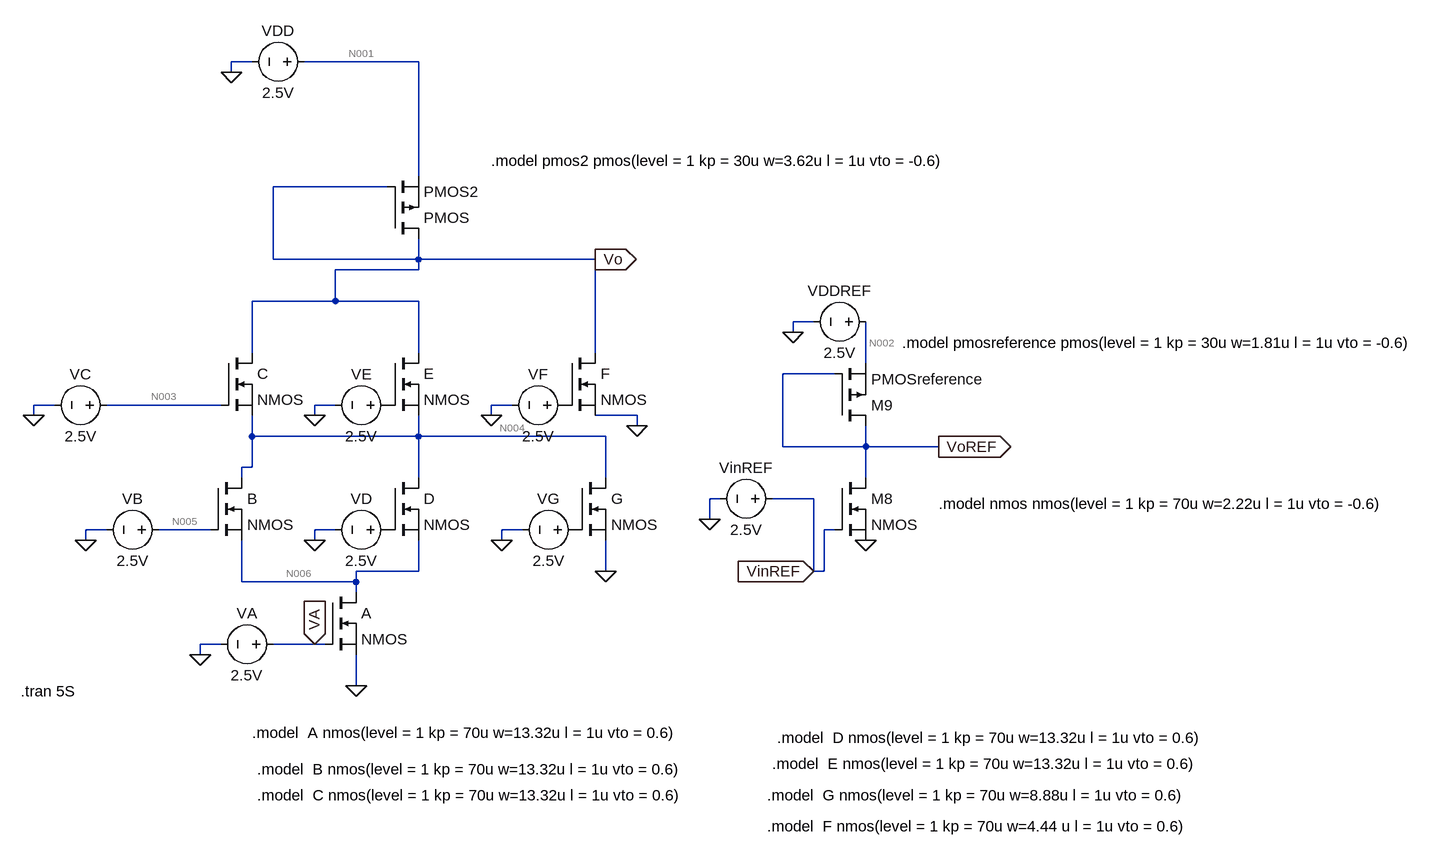
[diagram p0: schematic Draft3.asc]
Draft3.asc, the LTspice schematic file:
Version 4
SHEET 1 2076 752
WIRE 96 -448 64 -448
WIRE 352 -448 176 -448
WIRE 64 -432 64 -448
WIRE 352 -272 352 -448
WIRE 304 -256 128 -256
WIRE 128 -144 128 -256
WIRE 352 -144 352 -176
WIRE 352 -144 128 -144
WIRE 624 -144 352 -144
WIRE 352 -128 352 -144
WIRE 352 -128 224 -128
WIRE 224 -80 224 -128
WIRE 224 -80 96 -80
WIRE 352 -80 224 -80
WIRE 960 -48 928 -48
WIRE 928 -32 928 -48
WIRE 96 0 96 -80
WIRE 352 0 352 -80
WIRE 624 0 624 -144
WIRE 1040 16 1040 -48
WIRE 992 32 912 32
WIRE -208 80 -240 80
WIRE 48 80 -128 80
WIRE 224 80 192 80
WIRE 496 80 464 80
WIRE -240 96 -240 80
WIRE 192 96 192 80
WIRE 464 96 464 80
WIRE 688 96 624 96
WIRE 688 112 688 96
WIRE 96 128 96 96
WIRE 352 128 352 96
WIRE 352 128 96 128
WIRE 640 128 352 128
WIRE 912 144 912 32
WIRE 1040 144 1040 112
WIRE 1040 144 912 144
WIRE 1152 144 1040 144
WIRE 96 176 96 128
WIRE 96 176 80 176
WIRE 80 192 80 176
WIRE 352 192 352 128
WIRE 640 192 640 128
WIRE 1040 192 1040 144
WIRE 816 224 800 224
WIRE 960 224 896 224
WIRE 800 256 800 224
WIRE -128 272 -160 272
WIRE 32 272 -48 272
WIRE 224 272 192 272
WIRE 512 272 480 272
WIRE 992 272 976 272
WIRE -160 288 -160 272
WIRE 192 288 192 272
WIRE 480 288 480 272
WIRE 352 336 352 288
WIRE 352 336 256 336
WIRE 640 336 640 288
WIRE 960 336 960 224
WIRE 976 336 976 272
WIRE 976 336 960 336
WIRE 80 352 80 288
WIRE 256 352 256 336
WIRE 256 352 80 352
WIRE 256 368 256 352
WIRE 48 448 16 448
WIRE 192 448 128 448
WIRE 208 448 192 448
WIRE 16 464 16 448
WIRE 256 512 256 464
FLAG 64 -432 0
FLAG 688 112 0
FLAG 640 336 0
FLAG -240 96 0
FLAG -160 288 0
FLAG 192 96 0
FLAG 192 288 0
FLAG 464 96 0
FLAG 480 288 0
FLAG 16 464 0
FLAG 800 256 0
FLAG 1040 288 0
FLAG 928 -32 0
FLAG 1152 144 VoREF
IOPIN 1152 144 Out
FLAG 624 -144 Vo
IOPIN 624 -144 Out
FLAG 192 448 VA
IOPIN 192 448 In
FLAG 960 336 VinREF
IOPIN 960 336 In
FLAG 256 512 0
SYMBOL nmos 48 0 R0
SYMATTR InstName C
SYMBOL nmos 304 0 R0
SYMATTR InstName E
SYMBOL nmos 576 0 R0
SYMATTR InstName F
SYMBOL nmos 32 192 R0
SYMATTR InstName B
SYMBOL nmos 304 192 R0
SYMATTR InstName D
SYMBOL nmos 208 368 R0
SYMATTR InstName A
SYMBOL nmos 592 192 R0
SYMATTR InstName G
SYMBOL nmos 992 192 R0
SYMATTR InstName M8
SYMBOL pmos 992 112 M180
SYMATTR InstName M9
SYMATTR Value PMOSreference
SYMBOL pmos 304 -176 M180
SYMATTR InstName PMOS
SYMATTR Value PMOS2
SYMBOL voltage 192 -448 R90
WINDOW 0 -32 56 VBottom 2
WINDOW 3 32 56 VTop 2
SYMATTR InstName VDD
SYMATTR Value 2.5V
SYMBOL voltage -112 80 R90
WINDOW 0 -32 56 VBottom 2
WINDOW 3 32 56 VTop 2
WINDOW 123 0 0 Left 2
WINDOW 39 0 0 Left 2
SYMATTR InstName VC
SYMATTR Value 2.5V
SYMBOL voltage -32 272 R90
WINDOW 0 -32 56 VBottom 2
WINDOW 3 32 56 VTop 2
SYMATTR InstName VB
SYMATTR Value 2.5V
SYMBOL voltage 320 80 R90
WINDOW 0 -32 56 VBottom 2
WINDOW 3 32 56 VTop 2
SYMATTR InstName VE
SYMATTR Value 2.5V
SYMBOL voltage 320 272 R90
WINDOW 0 -32 56 VBottom 2
WINDOW 3 32 56 VTop 2
SYMATTR InstName VD
SYMATTR Value 2.5V
SYMBOL voltage 592 80 R90
WINDOW 0 -32 56 VBottom 2
WINDOW 3 32 56 VTop 2
SYMATTR InstName VF
SYMATTR Value 2.5V
SYMBOL voltage 608 272 R90
WINDOW 0 -32 56 VBottom 2
WINDOW 3 32 56 VTop 2
SYMATTR InstName VG
SYMATTR Value 2.5V
SYMBOL voltage 144 448 R90
WINDOW 0 -32 56 VBottom 2
WINDOW 3 32 56 VTop 2
SYMATTR InstName VA
SYMATTR Value 2.5V
SYMBOL voltage 912 224 R90
WINDOW 0 -32 56 VBottom 2
WINDOW 3 32 56 VTop 2
SYMATTR InstName VinREF
SYMATTR Value 2.5V
SYMBOL voltage 1056 -48 R90
WINDOW 0 -32 56 VBottom 2
WINDOW 3 32 56 VTop 2
SYMATTR InstName VDDREF
SYMATTR Value 2.5V
TEXT 1096 -16 Left 2 !.model pmosreference pmos(level = 1 kp = 30u w=1.81u l = 1u vto = -0.6)
TEXT 1152 232 Left 2 !.model nmos nmos(level = 1 kp = 70u w=2.22u l = 1u vto = -0.6)
TEXT -260 520 Left 2 !.tran 5S
TEXT 464 -296 Left 2 !.model pmos2 pmos(level = 1 kp = 30u w=3.62u l = 1u vto = -0.6)
TEXT 96 584 Left 2 !.model  A nmos(level = 1 kp = 70u w=13.32u l = 1u vto = 0.6)
TEXT 104 640 Left 2 !.model  B nmos(level = 1 kp = 70u w=13.32u l = 1u vto = 0.6)
TEXT 104 680 Left 2 !.model  C nmos(level = 1 kp = 70u w=13.32u l = 1u vto = 0.6)
TEXT 904 592 Left 2 !.model  D nmos(level = 1 kp = 70u w=13.32u l = 1u vto = 0.6)
TEXT 896 632 Left 2 !.model  E nmos(level = 1 kp = 70u w=13.32u l = 1u vto = 0.6)
TEXT 888 680 Left 2 !.model  G nmos(level = 1 kp = 70u w=8.88u l = 1u vto = 0.6)
TEXT 888 728 Left 2 !.model  F nmos(level = 1 kp = 70u w=4.44 u l = 1u vto = 0.6)

The netlist it stands for:
* Draft3.asc
M§C Vo N003 N004 N004 NMOS
M§E Vo P001 N004 N004 NMOS
M§F Vo P002 0 0 NMOS
M§B N004 N005 N006 N006 NMOS
M§D N004 P003 N006 N006 NMOS
M§A N006 VA 0 0 NMOS
M§G N004 P004 0 0 NMOS
M8 VoREF VinREF 0 0 NMOS
M9 VoREF VoREF N002 N002 PMOSreference
M§PMOS Vo Vo N001 N001 PMOS2
VDD N001 0 2.5V
VC N003 0 2.5V
VB N005 0 2.5V
VE P001 0 2.5V
VD P003 0 2.5V
VF P002 0 2.5V
VG P004 0 2.5V
VA VA 0 2.5V
VinREF VinREF 0 2.5V
VDDREF N002 0 2.5V
.model NMOS NMOS
.model PMOS PMOS
.lib standard.mos
.model pmosreference pmos(level = 1 kp = 30u w=1.81u l = 1u vto = -0.6)
.model nmos nmos(level = 1 kp = 70u w=2.22u l = 1u vto = -0.6)
.tran 5S
.model pmos2 pmos(level = 1 kp = 30u w=3.62u l = 1u vto = -0.6)
.model  A nmos(level = 1 kp = 70u w=13.32u l = 1u vto = 0.6)
.model  B nmos(level = 1 kp = 70u w=13.32u l = 1u vto = 0.6)
.model  C nmos(level = 1 kp = 70u w=13.32u l = 1u vto = 0.6)
.model  D nmos(level = 1 kp = 70u w=13.32u l = 1u vto = 0.6)
.model  E nmos(level = 1 kp = 70u w=13.32u l = 1u vto = 0.6)
.model  G nmos(level = 1 kp = 70u w=8.88u l = 1u vto = 0.6)
.model  F nmos(level = 1 kp = 70u w=4.44 u l = 1u vto = 0.6)
.backanno
.end

* Results of the author's LTspice run, read from the files saved beside the schematic
* Operating Point, zero values left out:
*   V(vo) = 179.9 mV
*   V(n003) = 2.5 V
*   V(n004) = 96.8 mV
*   V(p001) = 2.5 V
*   V(p002) = 2.5 V
*   V(n005) = 2.5 V
*   V(n006) = 64.19 mV
*   V(p003) = 2.5 V
*   V(va) = 2.5 V
*   V(p004) = 2.5 V
*   V(voref) = 172.9 mV
*   V(vinref) = 2.5 V
*   V(n002) = 2.5 V
*   V(n001) = 2.5 V
*   Id(Pmos) = -160.7 µA
*   Ib(Pmos) = 2.33 pA
*   Is(Pmos) = 160.7 µA
*   Id(M9) = -80.98 µA
*   Ib(M9) = 2.337 pA
*   Is(M9) = 80.98 µA
*   Id(M8) = 80.98 µA
*   Is(M8) = -80.98 µA
*   Id(G) = 45.9 µA
*   Is(G) = -45.9 µA
*   Id(A) = 30.6 µA
*   Id(D) = 15.3 µA
*   Is(D) = -15.3 µA
*   Id(B) = 15.3 µA
*   Is(B) = -15.3 µA
*   Id(F) = 84.15 µA
*   Is(F) = -84.15 µA
*   Id(E) = 38.25 µA
*   Is(E) = -38.25 µA
*   Id(C) = 38.25 µA
*   Is(C) = -38.25 µA
*   I(Vddref) = -80.98 µA
*   I(Vdd) = -160.7 µA